# EAGLE design b294_rev0 (EAGLE 9.6.2)
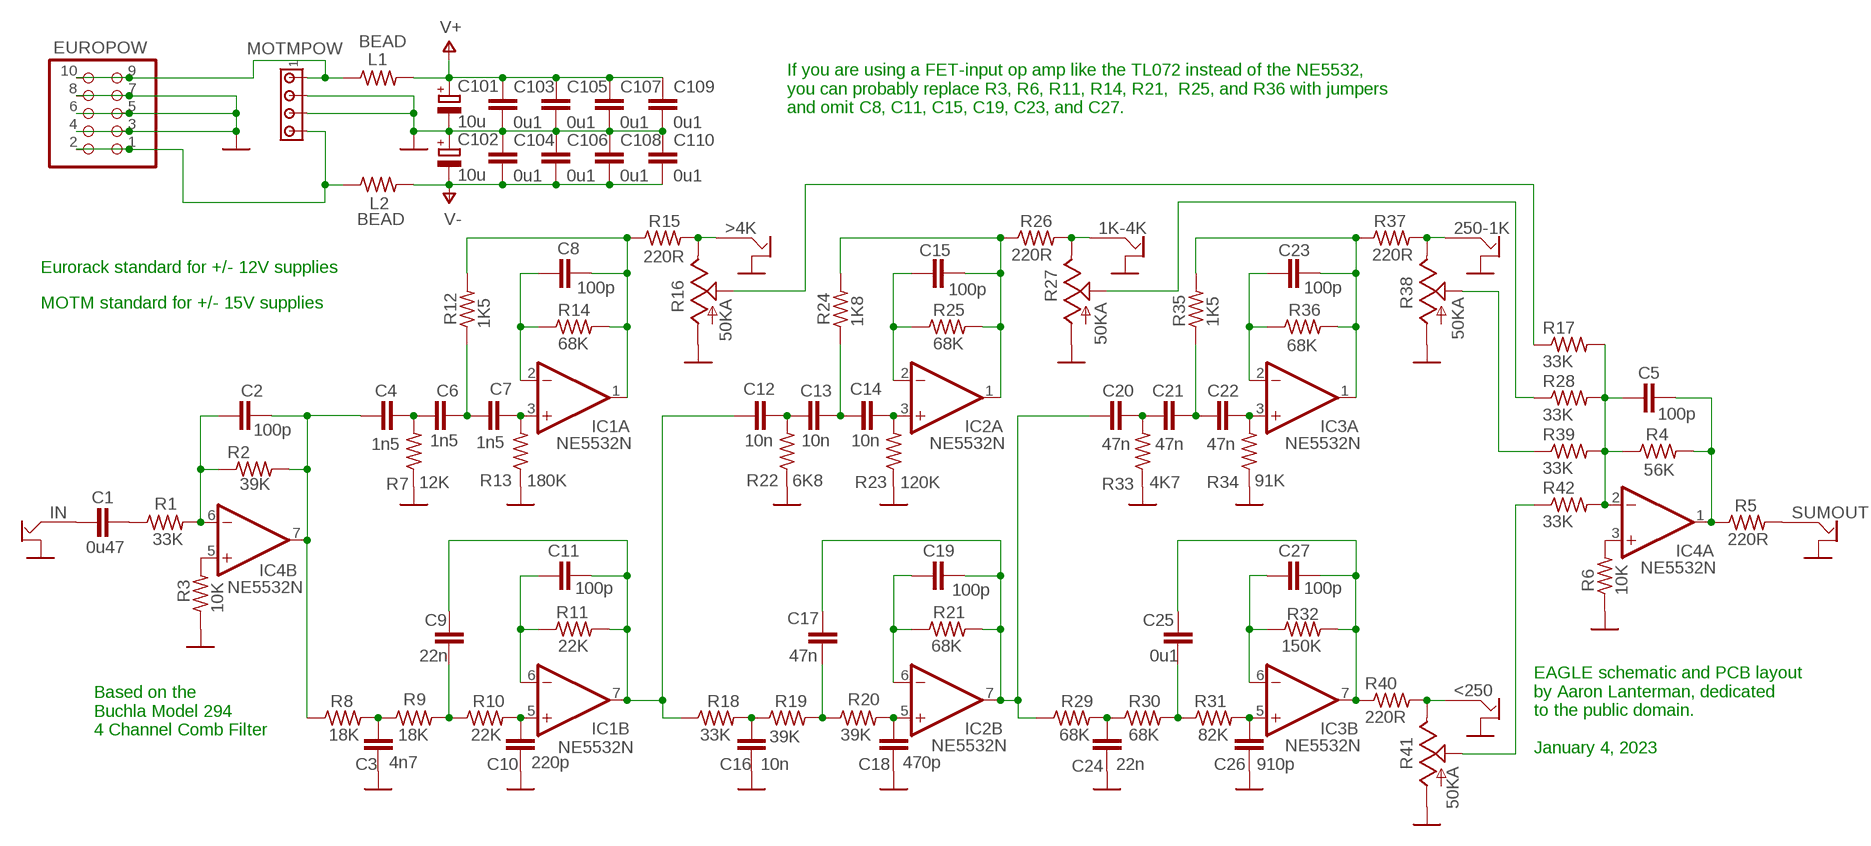
[diagram p0: schematic, sheet 1]

## Parts
1K-4K  OFFBOARD2JACKALT_AARON  [OFFBOARD2JACKALT]
250-1K  OFFBOARD2JACKALT_AARON  [OFFBOARD2JACKALT]
<250  OFFBOARD2JACKALT_AARON  [OFFBOARD2JACKALT]
>4K  OFFBOARD2JACKALT_AARON  [OFFBOARD2JACKALT]
C1  0u47  C-EU050-025X075  [C050-025X075]
C2  100p  C-EU050-025X075  [C050-025X075]
C3  4n7  C-EU050-025X075  [C050-025X075]
C4  1n5  C-EU050-025X075  [C050-025X075]
C5  100p  C-EU050-025X075  [C050-025X075]
C6  1n5  C-EU050-025X075  [C050-025X075]
C7  1n5  C-EU050-025X075  [C050-025X075]
C8  100p  C-EU050-025X075  [C050-025X075]
C9  22n  C-EU050-025X075  [C050-025X075]
C10  220p  C-EU050-025X075  [C050-025X075]
C11  100p  C-EU050-025X075  [C050-025X075]
C12  10n  C-EU050-025X075  [C050-025X075]
C13  10n  C-EU050-025X075  [C050-025X075]
C14  10n  C-EU050-025X075  [C050-025X075]
C15  100p  C-EU050-025X075  [C050-025X075]
C16  10n  C-EU050-025X075  [C050-025X075]
C17  47n  C-EU050-025X075  [C050-025X075]
C18  470p  C-EU050-025X075  [C050-025X075]
C19  100p  C-EU050-025X075  [C050-025X075]
C20  47n  C-EU050-025X075  [C050-025X075]
C21  47n  C-EU050-025X075  [C050-025X075]
C22  47n  C-EU050-025X075  [C050-025X075]
C23  100p  C-EU050-025X075  [C050-025X075]
C24  22n  C-EU050-025X075  [C050-025X075]
C25  0u1  C-EU050-025X075  [C050-025X075]
C26  910p  C-EU050-025X075  [C050-025X075]
C27  100p  C-EU050-025X075  [C050-025X075]
C101  10u  CPOL-EUE1.8-4  [E1,8-4]
C102  10u  CPOL-EUE1.8-4  [E1,8-4]
C103  0u1  C-EU050-025X075  [C050-025X075]
C104  0u1  C-EU050-025X075  [C050-025X075]
C105  0u1  C-EU050-025X075  [C050-025X075]
C106  0u1  C-EU050-025X075  [C050-025X075]
C107  0u1  C-EU050-025X075  [C050-025X075]
C108  0u1  C-EU050-025X075  [C050-025X075]
C109  0u1  C-EU050-025X075  [C050-025X075]
C110  0u1  C-EU050-025X075  [C050-025X075]
EUROPOW  PINHD-2X5  [2X05]
IC1  NE5532N  [DIL08]
IC2  NE5532N  [DIL08]
IC3  NE5532N  [DIL08]
IC4  NE5532N  [DIL08]
IN  OFFBOARD2JACKALT_AARON  [OFFBOARD2JACKALT]
L1  BEAD  R-US_0207/10  [0207/10]
L2  BEAD  R-US_0207/10  [0207/10]
MOTMPOW  MTA04-156  [1X4MTA]
R1  33K  R-US_0207/10  [0207/10]
R2  39K  R-US_0207/10  [0207/10]
R3  10K  R-US_0207/10  [0207/10]
R4  56K  R-US_0207/10  [0207/10]
R5  220R  R-US_0207/10  [0207/10]
R6  10K  R-US_0207/10  [0207/10]
R7  12K  R-US_0207/10  [0207/10]
R8  18K  R-US_0207/10  [0207/10]
R9  18K  R-US_0207/10  [0207/10]
R10  22K  R-US_0207/10  [0207/10]
R11  22K  R-US_0207/10  [0207/10]
R12  1K5  R-US_0207/10  [0207/10]
R13  180K  R-US_0207/10  [0207/10]
R14  68K  R-US_0207/10  [0207/10]
R15  220R  R-US_0207/10  [0207/10]
R16  50KA  TRIM_US-B64Y  [B64Y]
R17  33K  R-US_0207/10  [0207/10]
R18  33K  R-US_0207/10  [0207/10]
R19  39K  R-US_0207/10  [0207/10]
R20  39K  R-US_0207/10  [0207/10]
R21  68K  R-US_0207/10  [0207/10]
R22  6K8  R-US_0207/10  [0207/10]
R23  120K  R-US_0207/10  [0207/10]
R24  1K8  R-US_0207/10  [0207/10]
R25  68K  R-US_0207/10  [0207/10]
R26  220R  R-US_0207/10  [0207/10]
R27  50KA  TRIM_US-B64Y  [B64Y]
R28  33K  R-US_0207/10  [0207/10]
R29  68K  R-US_0207/10  [0207/10]
R30  68K  R-US_0207/10  [0207/10]
R31  82K  R-US_0207/10  [0207/10]
R32  150K  R-US_0207/10  [0207/10]
R33  4K7  R-US_0207/10  [0207/10]
R34  91K  R-US_0207/10  [0207/10]
R35  1K5  R-US_0207/10  [0207/10]
R36  68K  R-US_0207/10  [0207/10]
R37  220R  R-US_0207/10  [0207/10]
R38  50KA  TRIM_US-B64Y  [B64Y]
R39  33K  R-US_0207/10  [0207/10]
R40  220R  R-US_0207/10  [0207/10]
R41  50KA  TRIM_US-B64Y  [B64Y]
R42  33K  R-US_0207/10  [0207/10]
SUMOUT  OFFBOARD2JACKALT_AARON  [OFFBOARD2JACKALT]

## Nets
GND: 1K-4K.GND 250-1K.GND <250.GND >4K.GND C3.2 C10.2 C16.2 C18.2 C24.2 C26.2 C101.- C102.+ C103.2 C104.1 C105.2 C106.1 C107.2 C108.1 C109.2 C110.1 EUROPOW.3 EUROPOW.4 EUROPOW.5 EUROPOW.6 EUROPOW.7 EUROPOW.8 IN.GND MOTMPOW.2 MOTMPOW.3 R3.1 R6.1 R7.1 R13.1 R16.A R22.1 R23.1 R27.A R33.1 R34.1 R38.A R41.A SUMOUT.GND
N$1: C18.1 IC2.5(B:+IN) R20.2
N$2: C17.2 R19.2 R20.1
N$3: C16.1 R18.2 R19.1
N$4: C26.1 IC3.5(B:+IN) R31.2
N$5: C25.2 R30.2 R31.1
N$6: C24.1 R29.2 R30.1
N$7: C10.1 IC1.5(B:+IN) R10.2
N$8: >4K.SIGNAL R15.2 R16.E
N$9: C3.1 R8.2 R9.1
N$10: C11.1 IC1.6(B:-IN) R11.1
N$11: C9.1 C11.2 C12.1 IC1.7(B:OUT) R11.2 R18.1
N$12: C19.1 IC2.6(B:-IN) R21.1
N$13: C17.1 C19.2 C20.1 IC2.7(B:OUT) R21.2 R29.1
N$14: C2.2 C4.1 IC4.7(B:OUT) R2.2 R8.1
N$15: C25.1 C27.2 IC3.7(B:OUT) R32.2 R40.1
N$16: C2.1 IC4.6(B:-IN) R1.2 R2.1
N$17: C8.1 IC1.2(A:-IN) R14.1
N$18: C1.1 IN.SIGNAL
N$19: C15.1 IC2.2(A:-IN) R25.1
N$20: C15.2 IC2.1(A:OUT) R24.2 R25.2 R26.1
N$21: C23.1 IC3.2(A:-IN) R36.1
N$22: C23.2 IC3.1(A:OUT) R35.2 R36.2 R37.1
N$23: 1K-4K.SIGNAL R26.2 R27.E
N$24: C9.2 R9.2 R10.1
N$25: 250-1K.SIGNAL R37.2 R38.E
N$26: C7.2 IC1.3(A:+IN) R13.2
N$27: C27.1 IC3.6(B:-IN) R32.1
N$28: C6.2 C7.1 R12.1
N$29: C4.2 C6.1 R7.2
N$30: C14.2 IC2.3(A:+IN) R23.2
N$31: C13.2 C14.1 R24.1
N$32: C12.2 C13.1 R22.2
N$33: C22.2 IC3.3(A:+IN) R34.2
N$34: C21.2 C22.1 R35.1
N$35: C20.2 C21.1 R33.2
N$36: <250.SIGNAL R40.2 R41.E
N$37: C5.1 IC4.2(A:-IN) R4.1 R17.2 R28.2 R39.2 R42.2
N$38: R38.S R39.1
N$39: R27.S R28.1
N$40: R16.S R17.1
N$41: R41.S R42.1
N$42: C5.2 IC4.1(A:OUT) R4.2 R5.1
N$43: R5.2 SUMOUT.SIGNAL
N$44: IC4.3(A:+IN) R6.2
N$45: IC4.5(B:+IN) R3.2
N$46: C1.2 R1.1
N$47: EUROPOW.1 EUROPOW.2 L2.1 MOTMPOW.4
N$62: EUROPOW.9 EUROPOW.10 L1.1 MOTMPOW.1
P1: C8.2 IC1.1(A:OUT) R12.2 R14.2 R15.1
V+: C101.+ C103.1 C105.1 C107.1 C109.1 L1.2
V-: C102.- C104.2 C106.2 C108.2 C110.2 L2.2

## Notes on the sheet
- If you are using a FET-input op amp like the TL072 instead of the NE5532,
  you can probably replace R3, R6, R11, R14, R21,  R25, and R36 with jumpers
  and omit C8, C11, C15, C19, C23, and C27.
- Eurorack standard for +/- 12V supplies
- MOTM standard for +/- 15V supplies
- Based on the
  Buchla Model 294
  4 Channel Comb Filter
- EAGLE schematic and PCB layout
  by Aaron Lanterman, dedicated 
  to the public domain.
  
  January 4, 2023

## Power pins joined to a net without a drawn wire
V+: IC1.8(P:V+) IC2.8(P:V+) IC3.8(P:V+) IC4.8(P:V+)
V-: IC1.4(P:V-) IC2.4(P:V-) IC3.4(P:V-) IC4.4(P:V-)

## Library data of the parts
1K-4K 250-1K <250 >4K IN SUMOUT = aaronlibrary:OFFBOARD2JACKALT_AARON
C1-C27 C103-C110 = aaroncap:C-EU: CAPACITOR, European symbol
C101 C102 = rcl:CPOL-EU: POLARIZED CAPACITOR, European symbol
EUROPOW = pinhead:PINHD-2X5: PIN HEADER
IC1-IC4 = linear:NE5532: AUDIO AMPLIFIER
L1 L2 R1-R15 R17-R26 R28-R37 R39 R40 R42 = rcl:R-US_: RESISTOR, American symbol
MOTMPOW = con-amp:MTA04-156: AMP connector
R16 R27 R38 R41 = pot:TRIM_US-: POTENTIOMETER

## Board
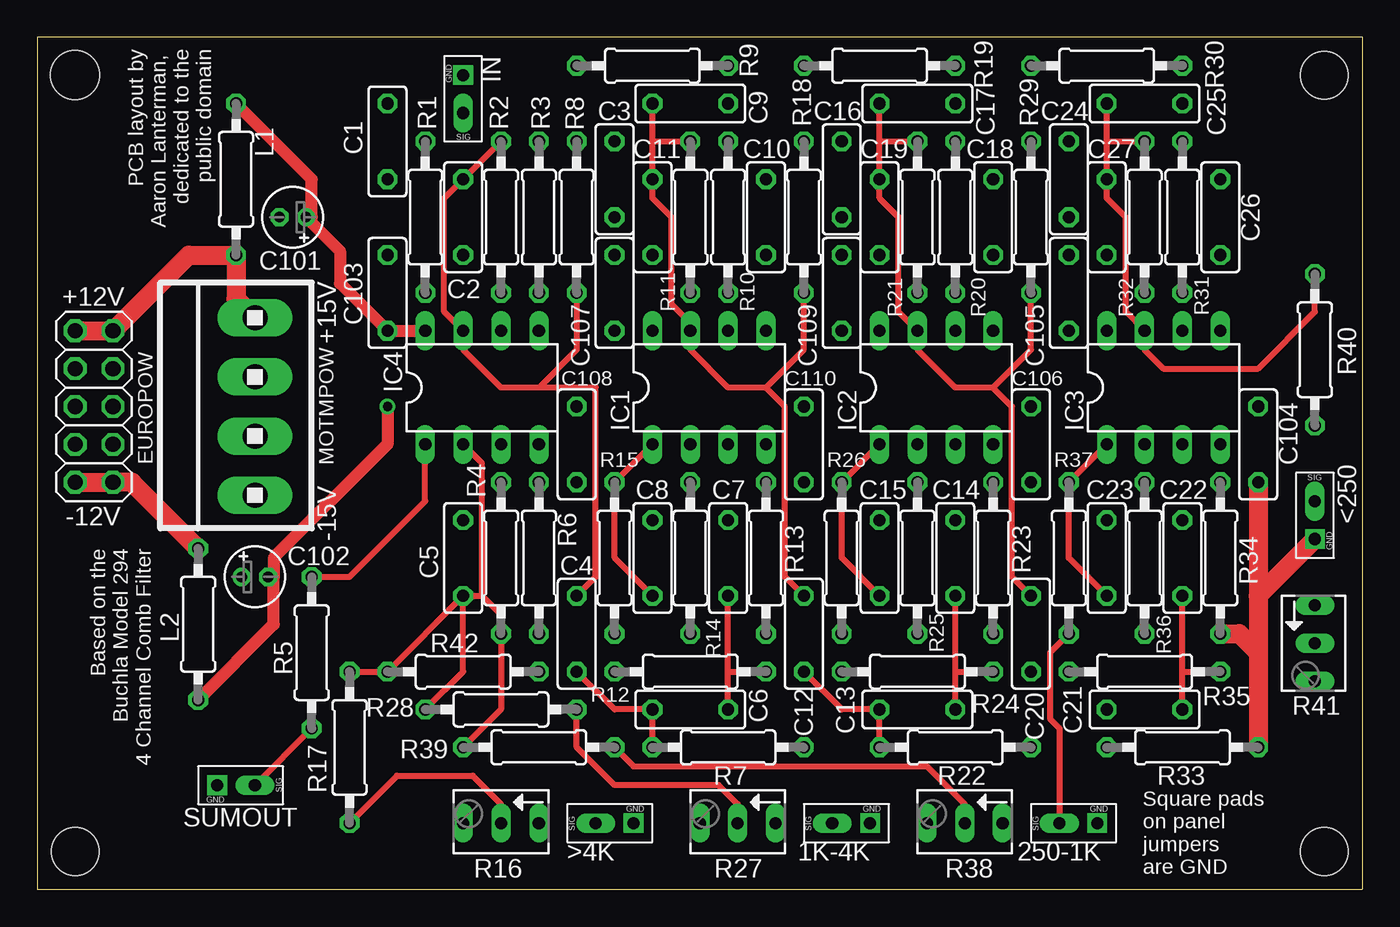
[diagram p1: board, top side]
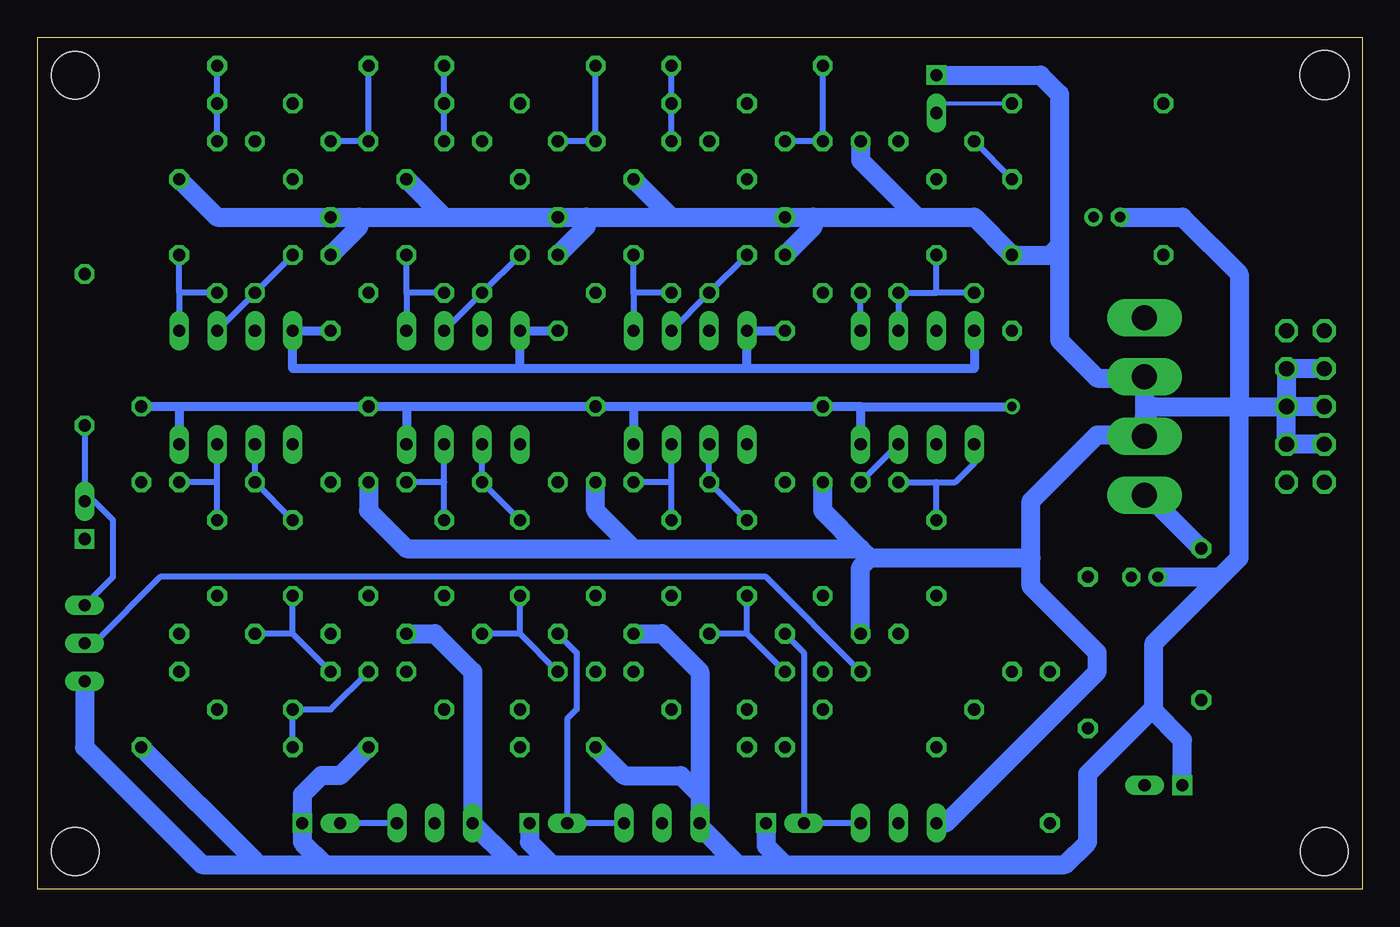
[diagram p2: board, bottom side, seen from below]

Size 88.9 x 57.15 mm. Coordinates in mm from the lower left corner, seen from the top.
Outline: 0,0 88.9,0 88.9,57.15 0,57.15 0,0
Copper layers (1*16): Top 0.035mm / dielectric 1.5mm / Bottom 0.035mm
Design rules "default": minimum track width 10mil, minimum drill 24mil, track to track 8mil, track to pad 8mil, pad to pad 8mil, via to via 8mil, smd to smd 8mil, copper to edge 40mil, drill to drill 8mil, minimum pad ring 10mil, minimum via ring 8mil, stop-mask expansion 4mil, vias tented up to drill 0mil, thermal gap 10mil
Holes 3.3 mm at 2.54,54.61
Holes 3.2 mm at 86.36,54.61 86.36,2.54 2.54,2.54

### Footprints (pad centres in the part's own frame; a part is rotated, then mirrored left to right if it is on the bottom)
OFFBOARD2JACKALT = drill 0.813 square: GND -1.27,-1.27 | drill 0.813 long: SIGNAL -1.27,1.27
C050-025X075 = drill 0.813 octagon: 1 -2.54,0; 2 2.54,0
E1,8-4 = drill 0.711 pad 1.168: + -0.889,0 | drill 0.711 pad 1.168 octagon: - 0.889,0
2X05 = drill 1.016 octagon: 1 -5.08,-1.27; 2 -5.08,1.27; 3 -2.54,-1.27; 4 -2.54,1.27; 5 0,-1.27; 6 0,1.27; 7 2.54,-1.27; 8 2.54,1.27; 9 5.08,-1.27; 10 5.08,1.27
DIL08 = drill 0.813 long: 1 -3.81,-3.81; 2 -1.27,-3.81; 3 1.27,-3.81; 4 3.81,-3.81; 5 3.81,3.81; 6 1.27,3.81; 7 -1.27,3.81; 8 -3.81,3.81
0207/10 = drill 0.813 octagon: 1 -5.08,0; 2 5.08,0
1X4MTA = drill 1.676 long: 1 5.944,0; 2 1.981,0; 3 -1.981,0; 4 -5.944,0
B64Y = drill 0.813 long: A 2.54,0; E -2.54,0; S 0,0

### Placement (x,y rotation side)
1K-4K  54.61,5.71 90 top
250-1K  69.85,5.71 90 top
<250  87,24.77 0 top
>4K  38.73,5.71 90 top
C1  23.5,50.16 270 top
C2  28.57,45.09 90 top
C3  38.73,47.62 270 top
C4  36.2,17.14 270 top
C5  28.57,22.23 90 top
C6  43.81,12.06 0 top
C7  46.35,22.23 90 top
C8  41.27,22.23 270 top
C9  43.81,52.7 0 top
C10  48.9,45.09 90 top
C11  41.27,45.09 90 top
C12  51.44,17.14 270 top
C13  59.05,12.06 0 top
C14  61.59,22.23 90 top
C15  56.52,22.23 270 top
C16  53.98,47.62 270 top
C17  59.05,52.7 0 top
C18  64.14,45.09 90 top
C19  56.52,45.09 90 top
C20  66.67,17.14 270 top
C21  74.3,12.06 0 top
C22  76.83,22.23 90 top
C23  71.75,22.23 270 top
C24  69.22,47.62 270 top
C25  74.3,52.7 0 top
C26  79.38,45.09 90 top
C27  71.75,45.09 90 top
C101  17.14,45.09 180 top
C102  14.61,20.95 0 top
C103  23.5,40.01 90 top
C104  81.92,29.84 90 top
C105  69.22,40.01 90 top
C106  66.67,29.84 90 top
C107  38.73,40.01 90 top
C108  36.2,29.84 90 top
C109  53.98,40.01 90 top
C110  51.44,29.84 90 top
EUROPOW  3.81,32.38 90 top
IC1  45.09,33.66 0 top
IC2  60.33,33.66 0 top
IC3  75.56,33.66 0 top
IC4  29.84,33.66 0 top
IN  27.3,53.34 180 top
L1  13.34,47.62 90 top
L2  10.79,17.78 270 top
MOTMPOW  14.61,32.38 90 top
R1  26.04,45.09 270 top
R2  31.11,45.09 90 top
R3  33.66,45.09 270 top
R4  31.11,22.23 90 top
R5  18.41,15.88 270 top
R6  33.66,22.23 90 top
R7  46.35,9.53 180 top
R8  36.2,45.09 90 top
R9  41.27,55.24 0 top
R10  46.35,45.09 270 top
R11  43.81,45.09 90 top
R12  43.81,14.61 180 top
R13  48.9,22.23 90 top
R14  43.81,22.23 270 top
R15  38.73,22.23 270 top
R16  31.11,4.45 180 top
R17  20.95,9.53 90 top
R18  51.44,45.09 90 top
R19  56.52,55.24 0 top
R20  61.59,45.09 270 top
R21  59.05,45.09 90 top
R22  61.59,9.53 180 top
R23  64.14,22.23 90 top
R24  59.05,14.61 180 top
R25  59.05,22.23 270 top
R26  53.98,22.23 270 top
R27  46.99,4.45 180 top
R28  31.11,12.06 180 top
R29  66.67,45.09 90 top
R30  71.75,55.24 0 top
R31  76.83,45.09 270 top
R32  74.3,45.09 90 top
R33  76.83,9.53 180 top
R34  79.38,22.23 90 top
R35  74.3,14.61 180 top
R36  74.3,22.23 270 top
R37  69.22,22.23 270 top
R38  62.23,4.45 180 top
R39  33.66,9.53 180 top
R40  85.72,36.2 270 top
R41  85.72,16.51 270 top
R42  28.57,14.61 180 top
SUMOUT  13.34,5.71 270 top

### Tracks (layer width: path | path; a pad name or v marks a point on that pad's centre or on a via)
GND
  Top 1.27: R34.1 80.64,17.14 81.92,15.88 | 81.92,15.88 R33.1 | 81.92,19.68 81.92,15.88 | <250.GND 81.92,19.68 | C104.1 81.92,19.68
  Bottom 1.27: R7.1 49.53,7.62 45.72,7.62 44.45,6.35 | 44.45,6.35 R27.A 44.45,4.19 41.91,1.65 | IN.GND 21.59,54.61 20.32,53.34 20.32,43.18 | 20.32,43.18 20.95,42.55 C103.2 26.04,45.09 29.84,45.09 | R3.1 33.66,48.9 29.84,45.09 | 36.83,45.09 C3.2 46.35,45.09 | 36.83,45.09 29.84,45.09 | C10.2 46.35,45.09 | 52.07,45.09 C16.2 61.59,45.09 | 52.07,45.09 46.35,45.09 | C18.2 61.59,45.09 | 67.31,45.09 C24.2 76.83,45.09 C26.2 | 67.31,45.09 61.59,45.09 | R16.A 27.94,4.45 17.78,14.61 17.78,15.88 22.23,20.32 22.23,22.23 | 33.02,22.23 22.23,22.23 | 33.66,22.86 36.2,25.4 C108.1 | 33.66,22.86 33.02,22.23 | R6.1 33.66,21.59 33.02,22.23 | 48.9,22.86 51.44,25.4 C110.1 | 48.9,22.86 33.66,22.86 | 48.9,22.86 64.14,22.86 66.67,25.4 C106.1 | >4K.GND 40.01,2.92 38.73,1.65 | 38.73,1.65 19.94,1.65 18.41,3.17 18.41,7.75 14.1,12.06 | 1K-4K.GND 55.88,3.17 54.36,1.65 | 54.36,1.65 41.91,1.65 | 41.91,1.65 38.73,1.65 | 69.6,1.65 57.15,1.65 | 57.15,1.65 54.36,1.65 | 69.6,1.65 71.12,3.17 250-1K.GND 71.12,6.35 69.85,7.62 68.58,7.62 R22.1 | R41.A 85.72,9.53 77.85,1.65 74.3,1.65 | 74.3,1.65 69.6,1.65 | R33.1 74.3,1.91 74.3,1.65 | R13.1 46.99,17.14 44.45,14.61 44.45,6.35 | 57.15,1.65 57.15,1.91 R38.A 59.69,14.61 62.23,17.14 R23.1 | 20.32,43.18 20.32,36.83 17.78,34.29 14.68,34.29 MOTMPOW.2 14.61,31.75 | 22.23,22.23 22.23,26.04 17.78,30.48 14.68,30.48 MOTMPOW.3 14.61,31.75 | 14.61,31.75 13.97,32.38 8.26,32.38 | 8.26,32.38 EUROPOW.5 | EUROPOW.6 EUROPOW.5 | EUROPOW.8 EUROPOW.7 EUROPOW.5 | EUROPOW.4 EUROPOW.3 EUROPOW.5 | C102.+ 9.53,20.95 | 9.53,20.95 8.26,22.23 8.26,32.38 | C101.- 12.06,45.09 8.26,41.27 8.26,32.38 | C107.2 36.83,44.45 36.83,45.09 | C109.2 52.07,44.45 52.07,45.09
  Bottom 1.27: C105.2 67.31,44.45 67.31,45.09 | 14.1,12.06 13.97,12.06 13.97,16.51 9.53,20.95 | SUMOUT.GND 12.06,10.03 14.1,12.06
N$1
  Bottom 0.406: R20.2 64.14,40.01 | 64.14,40.01 IC2.5 | 64.14,40.01 C18.1
N$2
  Bottom 0.406: R19.2 C17.2 R20.1
N$3
  Bottom 0.406: C16.1 R18.2 R19.1
N$4
  Bottom 0.406: 79.38,40.01 IC3.5 | 79.38,40.01 C26.1 | R31.2 79.38,40.01
N$5
  Bottom 0.406: R30.2 C25.2 R31.1
N$6
  Bottom 0.406: C24.1 R29.2 R30.1
N$7
  Bottom 0.406: 48.9,40.01 IC1.5 | R10.2 48.9,40.01 | 48.9,40.01 C10.1
N$8
  Bottom 0.406: R15.2 37.47,15.88 >4K.SIGNAL R16.E
N$9
  Bottom 0.406: R9.1 R8.2 C3.1
N$10
  Bottom 0.406: IC1.6 R11.1 C11.1
N$11
  Top 0.406: 41.27,50.16 R11.2 | 41.27,50.16 C9.1 | 41.27,50.16 C11.2 41.27,46.35 42.55,45.09 42.55,39.24 43.81,37.97 IC1.7 43.81,36.2 46.35,33.66 48.9,33.66 | 48.9,33.66 50.16,32.38 50.16,20.95 C12.1 | R18.1 51.44,36.2 48.9,33.66
N$12
  Bottom 0.406: C19.1 R21.1 IC2.6
N$13
  Top 0.406: 56.52,50.16 C19.2 56.52,46.35 57.78,45.09 57.78,38.73 IC2.7 59.05,36.2 61.59,33.66 64.14,33.66 | 56.52,50.16 C17.1 | 56.52,50.16 R21.2 | 64.14,33.66 65.41,32.38 65.41,20.95 C20.1 | R29.1 66.67,36.2 64.14,33.66
N$14
  Top 0.406: 33.66,33.66 37.47,33.66 37.47,20.95 C4.1 | 33.66,33.66 31.11,33.66 28.57,36.2 IC4.7 27.3,38.73 27.3,46.35 C2.2 R2.2 | R8.1 36.2,36.2 33.66,33.66
N$15
  Top 0.406: 71.75,50.16 R32.2 | 71.75,50.16 C27.2 71.75,46.35 73.03,45.09 73.03,38.73 IC3.7 74.3,36.2 75.56,34.92 81.92,34.92 85.72,38.73 R40.1 | 71.75,50.16 C25.1
N$16
  Bottom 0.406: IC4.6 R2.1 28.57,40.01 | R1.2 28.57,40.01 | 28.57,40.01 C2.1
N$17
  Bottom 0.406: IC1.2 R14.1 C8.1
N$18
  Bottom 0.254: C1.1 27.94,52.7 IN.SIGNAL
N$19
  Bottom 0.406: IC2.2 R25.1 C15.1
N$20
  Top 0.406: IC2.1 R26.1 53.98,22.23 C15.2
  Bottom 0.406: 56.52,17.14 C15.2 | 56.52,17.14 R25.2 | R24.2 56.52,17.14
N$21
  Bottom 0.406: IC3.2 R36.1 C23.1
N$22
  Top 0.406: IC3.1 R37.1 69.22,22.23 C23.2
  Bottom 0.406: R35.2 71.75,17.14 | 71.75,17.14 C23.2 | 71.75,17.14 R36.2
N$23
  Bottom 0.406: R26.2 52.7,15.88 52.7,12.06 53.34,11.43 1K-4K.SIGNAL R27.E
N$24
  Bottom 0.406: R10.1 C9.2 R9.2
N$25
  Top 0.406: R37.2 67.94,15.88 67.94,11.43 68.58,10.79 250-1K.SIGNAL
  Bottom 0.406: R38.E 250-1K.SIGNAL
N$26
  Bottom 0.406: C7.2 46.35,27.3 | 46.35,27.3 IC1.3 | 46.35,27.3 R13.2
N$27
  Bottom 0.406: C27.1 R32.1 IC3.6
N$28
  Top 0.406: C6.2 46.35,14.61 | 46.35,14.61 C7.1 | 46.35,14.61 R12.1
N$29
  Top 0.406: C4.2 38.73,12.06 C6.1 R7.2
N$30
  Bottom 0.406: 61.59,27.3 R23.2 | 61.59,27.3 IC2.3 | C14.2 61.59,27.3
N$31
  Top 0.406: C13.2 61.59,14.61 | 61.59,14.61 C14.1 | 61.59,14.61 R24.1
N$32
  Top 0.406: C12.2 53.98,12.06 C13.1 R22.2
N$33
  Bottom 0.406: 76.83,27.3 R34.2 | C22.2 76.83,27.3 | 76.83,27.3 IC3.3
N$34
  Top 0.406: 76.83,14.61 C22.1 | C21.2 76.83,14.61 | 76.83,14.61 R35.1
N$35
  Bottom 0.406: C20.2 69.22,12.06 C21.1 R33.2
N$36
  Bottom 0.406: R40.2 <250.SIGNAL 85.09,26.04 83.82,24.77 83.82,20.95 R41.E
N$37
  Top 0.406: C5.1 29.84,19.68 | 29.84,19.68 31.11,18.41 R4.1 31.11,12.06 R39.2 | 29.84,19.68 29.84,28.57 IC4.2 | C5.1 R42.2 R17.2 | R28.2 28.57,14.61 C5.1
N$38
  Top 0.406: R39.1 40.01,8.26 59.69,8.26 62.23,5.71 R38.S
N$39
  Top 0.406: R28.1 36.2,9.53 38.73,6.99 45.72,6.99 46.99,5.71 R27.S
N$40
  Top 0.406: R17.1 24.13,7.62 29.21,7.62 31.11,5.71 R16.S
N$41
  Bottom 0.406: R41.S 85.09,16.51 80.64,20.95 40.01,20.95 R42.1
N$42
  Top 0.406: R5.1 20.95,20.95 26.04,26.04 IC4.1
  Bottom 0.406: R4.2 28.57,27.3 | 28.57,27.3 27.3,27.3 26.04,28.57 IC4.1 | C5.2 28.57,27.3
N$43
  Top 0.406: SUMOUT.SIGNAL R5.2
N$44
  Bottom 0.406: R6.2 IC4.3
N$45
  Bottom 0.406: IC4.5 R3.2
N$46
  Bottom 0.406: C1.2 R1.1
N$47
  Top 1.27: L2.1 6.35,27.3 EUROPOW.1 EUROPOW.2
  Bottom 1.27: L2.1 14.38,26.44 MOTMPOW.4
N$62
  Top 1.27: MOTMPOW.1 13.34,39.6 L1.1 10.16,42.55 EUROPOW.9 EUROPOW.10
P1
  Top 0.406: IC1.1 R15.1 38.73,22.23 C8.2
  Bottom 0.406: R12.2 41.27,17.14 | 41.27,17.14 C8.2 | 41.27,17.14 R14.2
V+
  Top 0.61: C101.+ 18.41,45.09
  Top 0.813: IC4.8 C103.1 20.32,40.64 20.32,42.8 C101.+ | L1.2 18.41,47.62 18.41,45.09
  Bottom 0.61: IC4.8 26.04,34.92 41.27,34.92 | 41.27,34.92 IC1.8 C107.1 | 56.52,34.92 IC2.8 C109.1 | 41.27,34.92 56.52,34.92 | C105.1 IC3.8 71.75,34.92 56.52,34.92
V-  (via drill 0.61)
  Top 0.61: 15.88,20.95 C102.-
  Top 0.813: L2.2 15.88,17.78 15.88,20.95 15.88,22.23 23.5,29.84 v23.5,32.38
  Bottom 0.61: 64.14,32.38 C110.2 48.9,32.38 | 64.14,32.38 IC2.4 | 79.38,32.38 C106.2 64.14,32.38 | 79.38,32.38 IC3.4 | 48.9,32.38 C108.2 33.66,32.38 | 79.38,32.38 C104.2 | 48.9,32.38 IC1.4 | 33.66,32.38 v23.5,32.38 | 33.66,32.38 IC4.4

### Text on the board
tNames: PCB layout by / Aaron Lanterman, / dedicated to the / public domain | +12V | +15V | -12V | Based on the / Buchla Model 294 / 4 Channel Comb Filter | -15V | Square pads / on panel / jumpers / are GND